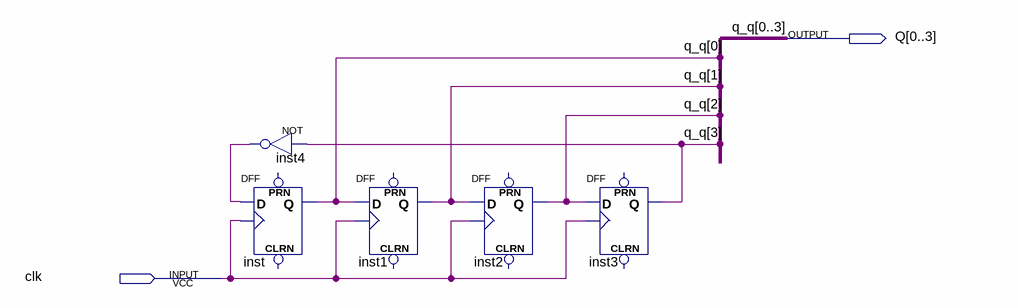
[diagram p0: schematic sheet]
// Quartus schematic sync_circular_couner_DTrigger.bdf as structural Verilog: 5 symbols, 2 pins
module sync_circular_couner_DTrigger (
  input  clk,
  output [0:3] Q
);

  wire inst4_out;

  DFF inst (.CLK(clk), .D(inst4_out), .Q(Q[0]));  // open: CLRN, PRN
  not inst4 (inst4_out, Q[3]);
  DFF inst1 (.CLK(clk), .D(Q[0]), .Q(Q[1]));  // open: CLRN, PRN
  DFF inst2 (.CLK(clk), .D(Q[1]), .Q(Q[2]));  // open: CLRN, PRN
  DFF inst3 (.CLK(clk), .D(Q[2]), .Q(Q[3]));  // open: CLRN, PRN

  // Other names for the same wires on the sheet: q_q[3:0] = {Q[3], Q[2], Q[1], Q[0]}
endmodule
